# EAGLE design multicharger (EAGLE 9.4.0)
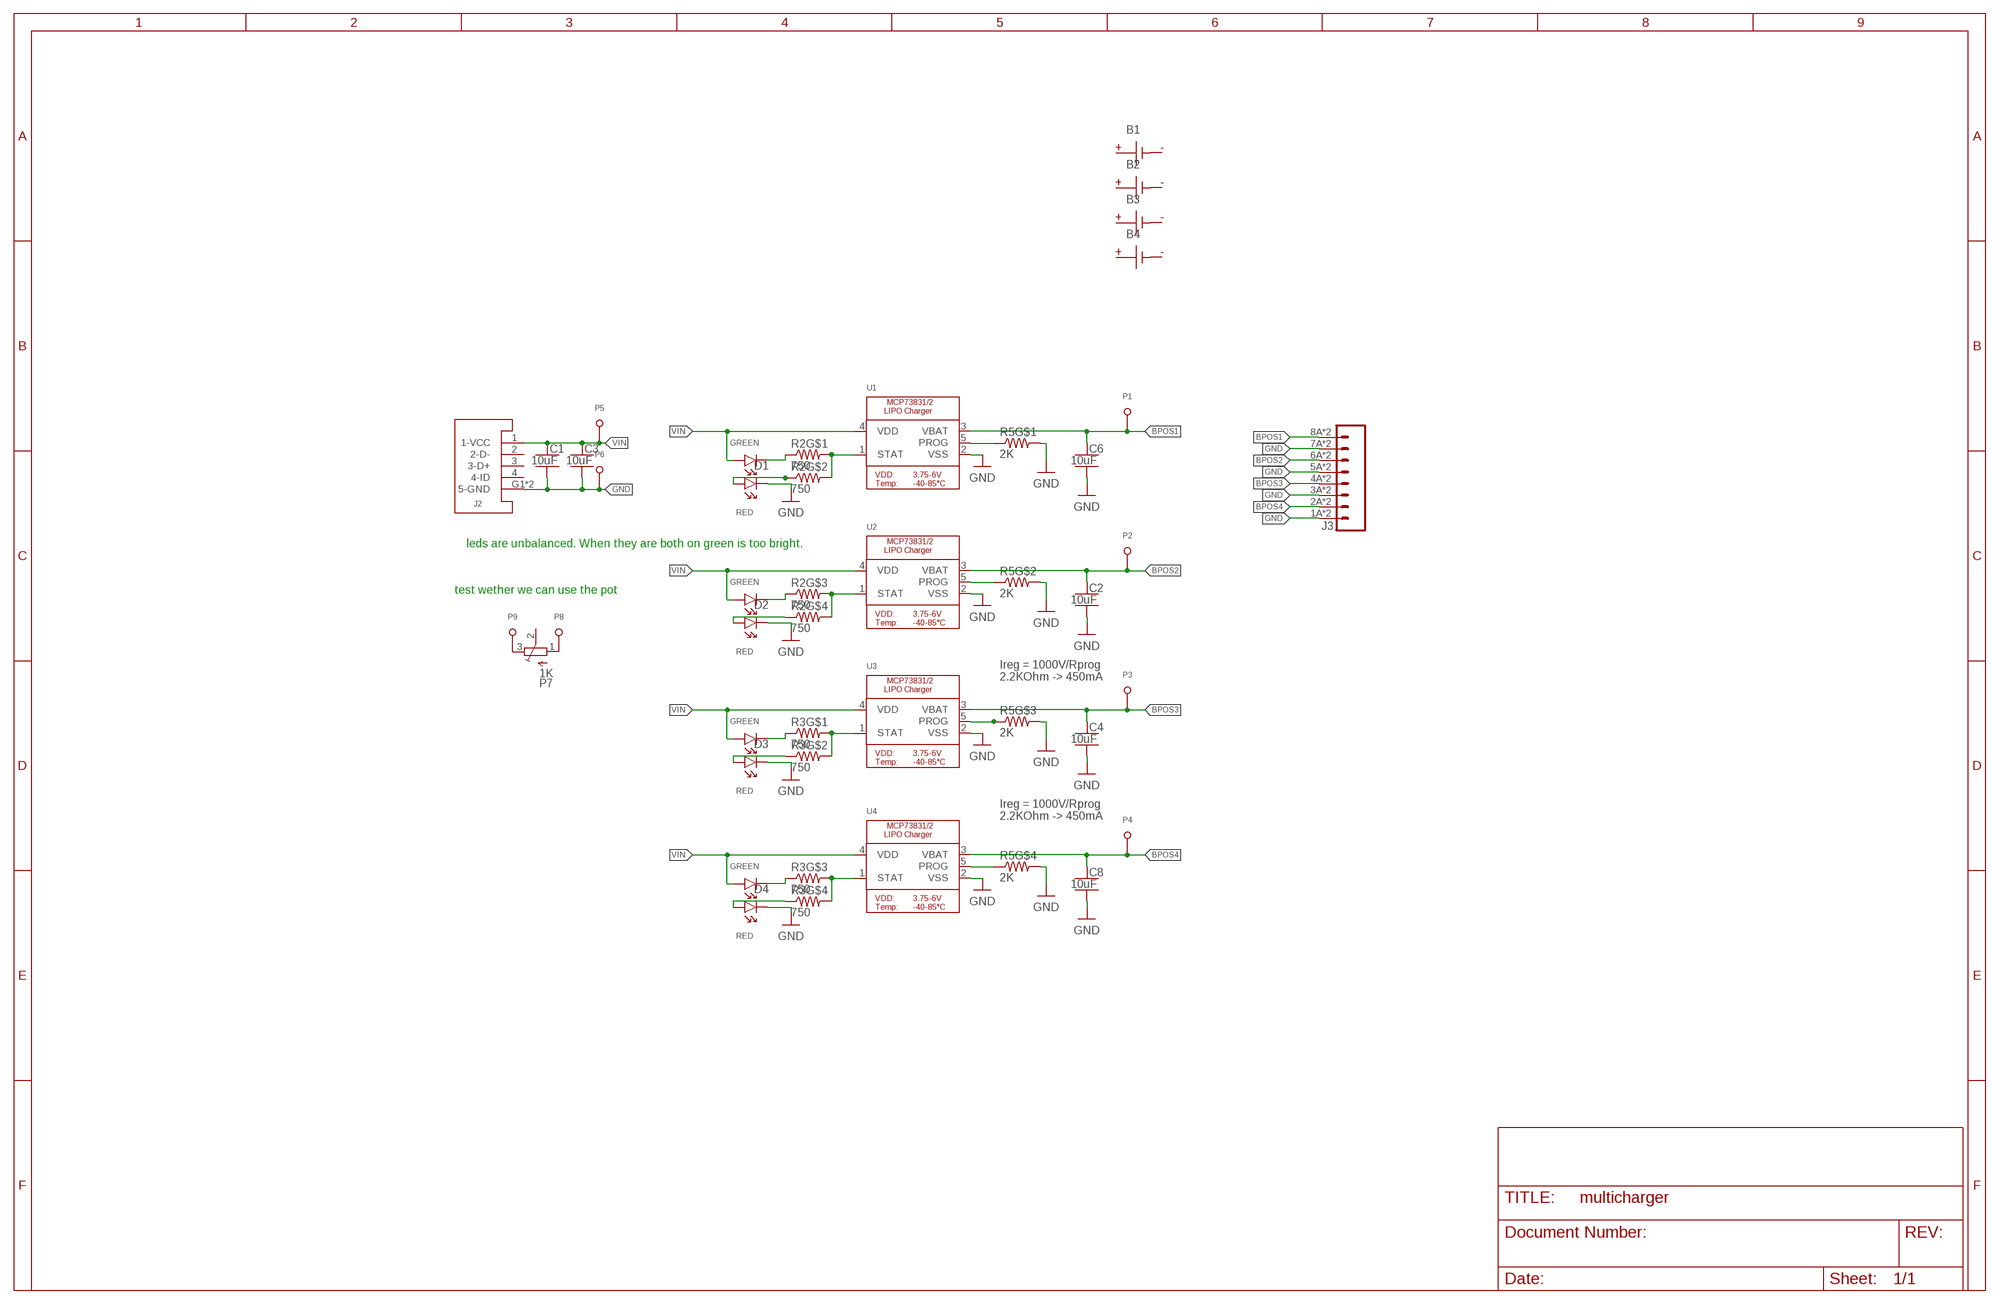
[diagram p0: schematic, sheet 1]
FRAME1 (FRAME_B_L): CREATOR: Unknown; DIST: Unknown; DISTPN: Unknown

## Parts
B1  BATTERY-SMD  [MOLEX-BATTERY-CONNECTOR-SMD-51005-2P]
B2  BATTERY-SMD  [MOLEX-BATTERY-CONNECTOR-SMD-51005-2P]
B3  BATTERY-SMD  [MOLEX-BATTERY-CONNECTOR-SMD-51005-2P]
B4  BATTERY-SMD  [MOLEX-BATTERY-CONNECTOR-SMD-51005-2P]
C1  10uF  CAPACITOR-NP_SMD-0603_CERAMIC-10UF  [CAPC1608X100]
C2  10uF  CAPACITOR-NP_SMD-0603_CERAMIC-10UF  [CAPC1608X100]
C3  10uF  CAPACITOR-NP_SMD-0603_CERAMIC-10UF  [CAPC1608X100]
C4  10uF  CAPACITOR-NP_SMD-0603_CERAMIC-10UF  [CAPC1608X100]
C6  10uF  CAPACITOR-NP_SMD-0603_CERAMIC-10UF  [CAPC1608X100]
C8  10uF  CAPACITOR-NP_SMD-0603_CERAMIC-10UF  [CAPC1608X100]
D1  LED-2X-GREEN/RED-1.6X1.5MM  [LED-2X-LITE-ON-1.6MMX1.5MM]
D2  LED-2X-GREEN/RED-1.6X1.5MM  [LED-2X-LITE-ON-1.6MMX1.5MM]
D3  LED-2X-GREEN/RED-1.6X1.5MM  [LED-2X-LITE-ON-1.6MMX1.5MM]
D4  LED-2X-GREEN/RED-1.6X1.5MM  [LED-2X-LITE-ON-1.6MMX1.5MM]
J2  USB-A-SMD-KEYSTONE-931  [USB-A-KEYSTONE-931]
J3  HEADER-8POS-  [WIRE-TERMINAL-1X8-2.5MM-SMD]
P1  TEST-POINT-1MM  [TEST-POINT-1MM-VIA]
P2  TEST-POINT-1MM  [TEST-POINT-1MM-VIA]
P3  TEST-POINT-1MM  [TEST-POINT-1MM-VIA]
P4  TEST-POINT-1MM  [TEST-POINT-1MM-VIA]
P5  TEST-POINT-1MM  [TEST-POINT-1MM-VIA]
P6  TEST-POINT-1MM  [TEST-POINT-1MM-VIA]
P7  1K  TRIMPOT-BOT-ADJUST-1K  [BOT-ADJUST-POT-3314R-1-103E]
P8  TEST-POINT-1MM  [TEST-POINT-1MM-VIA]
P9  TEST-POINT-1MM  [TEST-POINT-1MM-VIA]
R2  750  RESISTOR-PACK-4X-750  [RESCAXS50P200X100X45-8]
R3  750  RESISTOR-PACK-4X-750  [RESCAXS50P200X100X45-8]
R5  2K  RESISTOR-PACK-4X-2K  [RESCAXS50P200X100X45-8]
U1  MCP73831T-2ACI/OT  MCP73831/2  [SOT23-5]
U2  MCP73831T-2ACI/OT  MCP73831/2  [SOT23-5]
U3  MCP73831T-2ACI/OT  MCP73831/2  [SOT23-5]
U4  MCP73831T-2ACI/OT  MCP73831/2  [SOT23-5]

## Nets
BPOS1 [LONG_PWR]: C6.1 J3.8A J3.8B P1.T U1.3(VBAT)
BPOS2 [LONG_PWR]: C2.1 J3.6A J3.6B P2.T U2.3(VBAT)
BPOS3 [LONG_PWR]: C4.1 J3.4A J3.4B P3.T U3.3(VBAT)
BPOS4 [LONG_PWR]: C8.1 J3.2A J3.2B P4.T U4.3(VBAT)
GND [LONG_PWR]: C1.2 C2.2 C3.2 C4.2 C6.2 C8.2 D1.C1 D2.C1 D3.C1 D4.C1 J2.G1(5-GND) J2.G2(5-GND) J3.1A J3.1B J3.3A J3.3B J3.5A J3.5B J3.7A J3.7B P6.T R5.5 R5.6 R5.7 R5.8 U1.2(VSS) U2.2(VSS) U3.2(VSS) U4.2(VSS)
N$1: D1.A1 R2.3
N$2: D1.C2 R2.4
N$3: R2.7 R2.8 U2.1(STAT)
N$4: R5.3 U2.5(PROG)
N$5: D2.A1 R2.1
N$6: D2.C2 R2.2
N$7: R3.5 R3.6 U3.1(STAT)
N$8: R5.2 U3.5(PROG)
N$9: D3.A1 R3.3
N$10: D3.C2 R3.4
N$11: R2.5 R2.6 U1.1(STAT)
N$12: R5.4 U1.5(PROG)
N$13: R3.7 R3.8 U4.1(STAT)
N$14: R5.1 U4.5(PROG)
N$15: D4.A1 R3.1
N$16: D4.C2 R3.2
N$17: P7.1(A) P8.T
N$18: P7.3(E) P9.T
VIN [LONG_PWR]: C1.1 C3.1 D1.A2 D2.A2 D3.A2 D4.A2 J2.1(1-VCC) P5.T U1.4(VDD) U2.4(VDD) U3.4(VDD) U4.4(VDD)
Unconnected: B1.G2(N) B1.G3(N) B1.G(N) B1.P B2.G2(N) B2.G3(N) B2.G(N) B2.P B3.G2(N) B3.G3(N) B3.G(N) B3.P B4.G2(N) B4.G3(N) B4.G(N) B4.P J2.2(2-D-) J2.3(3-D+) J2.4(4-ID) P7.2(S)

## Notes on the sheet
- leds are unbalanced. When they are both on green is too bright.
- test wether we can use the pot
- Ireg = 1000V/Rprog
  2.2KOhm -> 450mA
- Ireg = 1000V/Rprog
  2.2KOhm -> 450mA

## Library data of the parts
B1-B4 = quadparts_prebuilt:BATTERY: Connections for a battery.
C1-C4 C6 C8 = quadparts_prebuilt:CAPACITOR-NP_: Nonpolarized capacitor; CREATOR: Swanson; DIST: Digikey; DISTPN: 1276-1119-1-ND; MOUNTING: SMD
D1-D4 = RemoteParts:LED-2X; COLOR1: GREEN; COLOR2: RED; CREATOR: Swanson; DIST: DIGIKEY; DISTPN: 160-2252-1-ND; MOUNTING: SMD
J2 = RemoteParts:USB
J3 = quadparts_prebuilt:HEADER-8POS-; CREATOR: Swanson; DIST: DIGIKEY; DISTPN: 478-6173-1-ND; MOUNTING: SMD; PIN1: -; PIN2: +; PIN3: -; PIN4: +; PIN5: -; PIN6: +; PIN7: -; PIN8: +
P1-P6 P8 P9 = RemoteParts:TEST-POINT
P7 = RemoteParts:TRIMPOT: SMT trimmer potentiometer part number TC33X http://www.ladyada.net/library/eagle; CREATOR: Swanson; DIST: DIGIKEY; DISTPN: 3314R-1-102ECT-ND; MOUNTING: SMD
R2 R3 = quadparts_prebuilt:RESISTOR-PACK-4X; CREATOR: Swanson; DIST: DIGIKEY; DISTPN: Y10751CT-ND; MOUNTING: SMD
R5 = quadparts_prebuilt:RESISTOR-PACK-4X; CREATOR: Swanson; DIST: DIGIKEY; DISTPN: Y10202CT-ND; MOUNTING: SMD
U1-U4 = RemoteParts:MCP73831/2: MCP73831/2 LIPO Charger VDD: 3.75 - 6V Temp -40 - 85°C Programmable Charge Rate: 15-500mA NOTE: STAT is a tri-state logic output on the MCP73831 and an open-drain output on the MCP73832. SOT23-5 with 4.2V output and tri-state logic on STAT = MCP73831T-2ACI/OT; CREATOR: Adafruit; DIST: DIGIKEY; DISTPN: MCP73831T-2ACI/OTCT-ND; MOUNTING: SMD

## Net classes
1 HIGH-I: drill 0.254 mm
3 PWR: drill 0.381 mm
4 LONG_PWR: width 0.508 mm, drill 0.381 mm

## Board
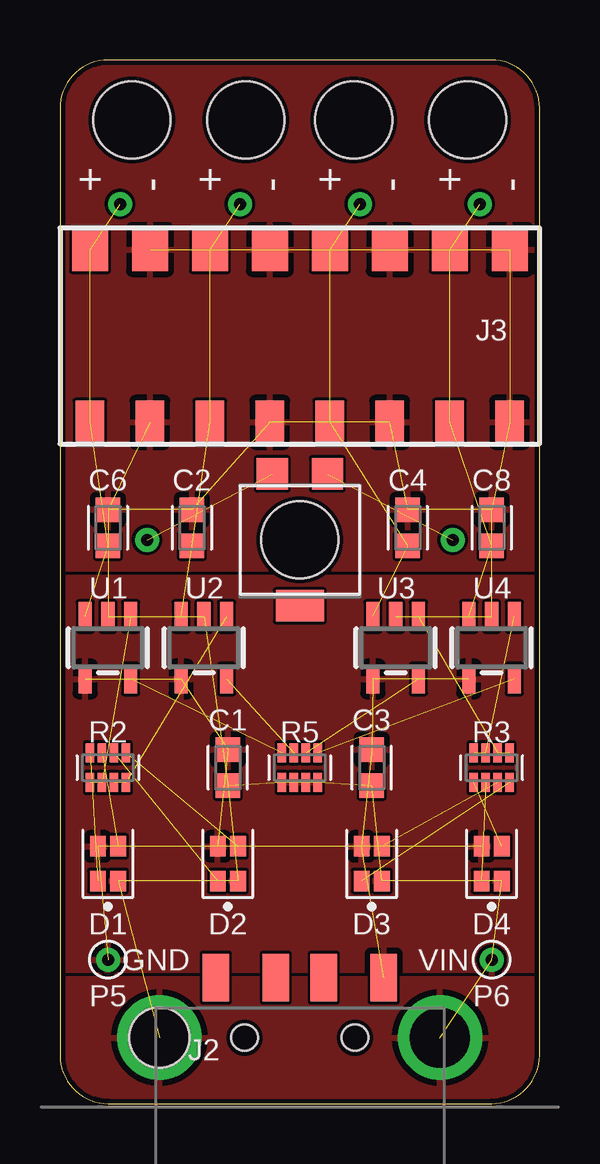
[diagram p1: board, top side]
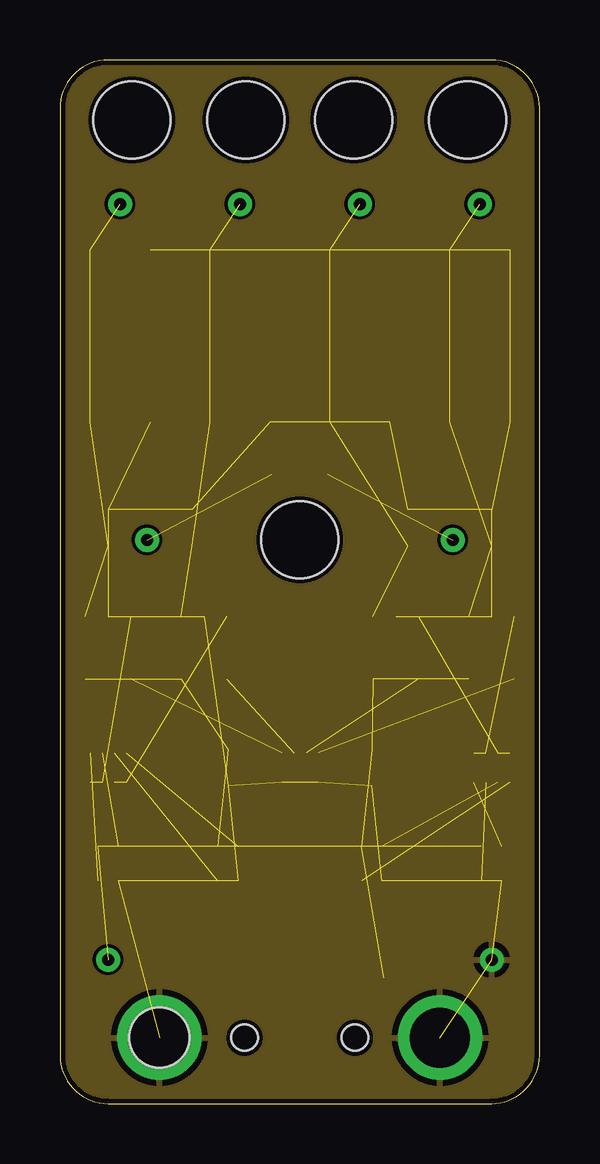
[diagram p2: board, inner layer Route2]
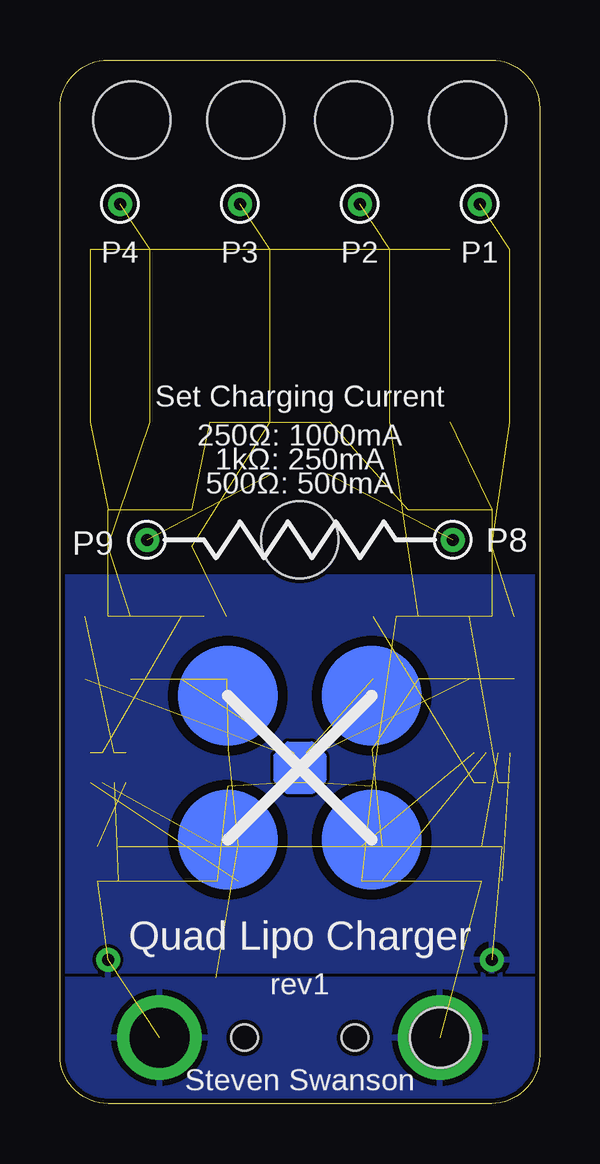
[diagram p3: board, bottom side, seen from below]

Size 20 x 43.5 mm. Coordinates in mm from the lower left corner, seen from the top.
Outline: 0,41.5 0,2 arc90 2,0 18,0 arc90 20,2 20,41.5 arc90 18,43.5 2,43.5 arc90 0,41.5
Copper layers (1*2*15*16): Top 0.035559375mm / dielectric 1.501140625mm / Route2 0.035559375mm / dielectric 0.149859375mm / Route15 0.035559375mm / dielectric 0.200659375mm / Bottom 0.035559375mm
Design rules "jlcpcb-4layer-5mil-small-cream": minimum track width 5mil, minimum drill 0.2mm, track to track 5mil, track to pad 5mil, pad to pad 5mil, via to via 5mil, smd to smd 5mil, copper to edge 0.2mm, drill to drill 10mil, minimum pad ring 3mil, minimum via ring 5mil, stop-mask expansion 0.05mm, vias tented up to drill 0.45mm, thermal gap 10mil
Holes 3.2 mm at 7.75,41 3,41 12.25,41 17,41

### Footprints (pad centres in the part's own frame; a part is rotated, then mirrored left to right if it is on the bottom)
MOLEX-BATTERY-CONNECTOR-SMD-51005-2P = smd 1.2 x 3: G -1,5.2 | smd 1.5 x 3.5: G2 -3.2,-0.45; G3 3.2,-0.45 | smd 1.1 x 3: P 1,5.2
CAPC1608X100 = smd 1.009 x 1.015: 1 -0.753,0; 2 0.753,0
LED-2X-LITE-ON-1.6MMX1.5MM = smd 0.85 x 0.65: A1 -0.725,0.425; A2 -0.725,-0.425; C1 0.725,0.425; C2 0.725,-0.425
USB-A-KEYSTONE-931 = smd 1.1 x 1.99: 1 -3.5,-1.25; 2 -1,-1.25; 3 1,-1.25; 4 3.5,-1.25 | drill 2.5: G1 -5.85,1.25; G2 5.85,1.25 | hole 2.5: 5.85,1.25 | hole 1.1: -2.3,1.25; 2.3,1.25
WIRE-TERMINAL-1X8-2.5MM-SMD = smd 1.8 x 1.5: 1A 3.6,-8.75; 2A 3.6,-6.25; 3A 3.6,-3.75; 4A 3.6,-1.25; 5A 3.6,1.25; 6A 3.6,3.75; 7A 3.6,6.25; 8A 3.6,8.75 | smd 1.8 x 1.2: 1B -3.6,-8.75; 2B -3.6,-6.25; 3B -3.6,-3.75; 4B -3.6,-1.25; 5B -3.6,1.25; 6B -3.6,3.75; 7B -3.6,6.25; 8B -3.6,8.75
TEST-POINT-1MM-VIA = drill 0.5 pad 1: T 0,0
BOT-ADJUST-POT-3314R-1-103E = smd 1.3 x 1.3: 1 -1.15,2.75; 3 1.15,2.75 | smd 2 x 1.3: 2 0,-2.75 | hole 3.2: 0,0
RESCAXS50P200X100X45-8 = smd 0.79 x 0.339: 1 -0.62,0.75; 2 -0.62,0.25; 3 -0.62,-0.25; 4 -0.62,-0.75; 5 0.62,-0.75; 6 0.62,-0.25; 7 0.62,0.25; 8 0.62,0.75
SOT23-5 = smd 0.55 x 1.2: 1 -0.95,-1.3; 2 0,-1.3; 3 0.95,-1.3; 4 0.95,1.3; 5 -0.95,1.3

### Placement (x,y rotation side)
B1  -45,17 270 top  (outside the outline)
B2  -35,9 90 top  (outside the outline)
B3  -45,1 270 top  (outside the outline)
B4  -35,-7 90 top  (outside the outline)
C1  7,14 270 top
C2  5.5,24 90 top
C3  13,14 270 top
C4  14.5,24 90 top
C6  2,24 90 top
C8  18,24 90 top
D1  2,10 270 top
D2  7,10 270 top
D3  13,10 270 top
D4  18,10 270 top
J2  10,4 180 top
J3  10,32 90 top
P1  2.5,37.5 0 bottom
P2  7.5,37.5 0 bottom
P3  12.5,37.5 0 bottom
P4  17.5,37.5 0 bottom
P5  2,6 0 top
P6  18,6 0 top
P7  10,23.5 0 top
P8  3.62,23.5 0 bottom
P9  16.38,23.5 0 bottom
R2  2,14 270 top
R3  18,14 90 top
R5  10,14 270 top
U1  2,19 180 top
U2  6,19 180 top
U3  14,19 180 top
U4  18,19 180 top
U$2  [QUADCLASS_LOGO]  10,14 0 bottom

### Tracks (layer width: path | path; a pad name or v marks a point on that pad's centre or on a via)
BPOS1  (4 unrouted)
BPOS2  (4 unrouted)
BPOS3  (4 unrouted)
BPOS4  (4 unrouted)
GND  (28 unrouted)
  pour Bottom (rank 2): -0.5,44.5 -0.5,-1 21,-1 21,44.5
  pour Top (rank 3): -1,45 -1,-1.5 21.5,-1.5 21.5,45
  pour Route2: -1.5,45.5 -1.5,-2 22,-2 22,45.5
N$1  (1 unrouted)
N$2  (1 unrouted)
N$3  (2 unrouted)
N$4  (1 unrouted)
N$5  (1 unrouted)
N$6  (1 unrouted)
N$7  (2 unrouted)
N$8  (1 unrouted)
N$9  (1 unrouted)
N$10  (1 unrouted)
N$11  (2 unrouted)
N$12  (1 unrouted)
N$13  (2 unrouted)
N$14  (1 unrouted)
N$15  (1 unrouted)
N$16  (1 unrouted)
N$17  (1 unrouted)
N$18  (1 unrouted)
VIN  (11 unrouted)
  pour Bottom: -2.5,22 23,22 23,5.5 -2.5,5.5
  pour Top (rank 2): -3,22 23.5,22 23.5,5.5 -3,5.5
(copper drawn outside any net)
  shapes: Top area x9

### Text on the board
Top: 1/2 inch of 3/16 heatshrink provides good strain relief for the plug end of the wiring harness | 1/2 inch of 3/16 heatshrink provides good strain relief for the plug end of the wiring harness | terminal block is a tight squeeze for the nicer battery cables we have. the cheaper, thinners ones are fine. | Add kapton tape to top of terminals to avoid scorching
tPlace: GND | VIN
bPlace: Set Charging Current | 250Ω: 1000mA | 1kΩ: 250mA | 500Ω: 500mA | Quad Lipo Charger | rev1 | Steven Swanson